# Altium project Power Distribution Board.PrjPcb (part 2 of 2)

## Sheet SH7 - LOAD MONITORING 2.SchDoc: Load Monitoring 2
size B; CheckedBy: Lance Bantoto; DrawnBy: Cindy Li; Engineer: Cindy Li; Organization: UW Robotics; Address1: 200 University Avenue; Address2: Waterloo; Address3: Ontario; Address4: Canada N2L 3G6; DocumentNumber: 7; Revision: 2; SheetNumber: 7; SheetTotal: 10
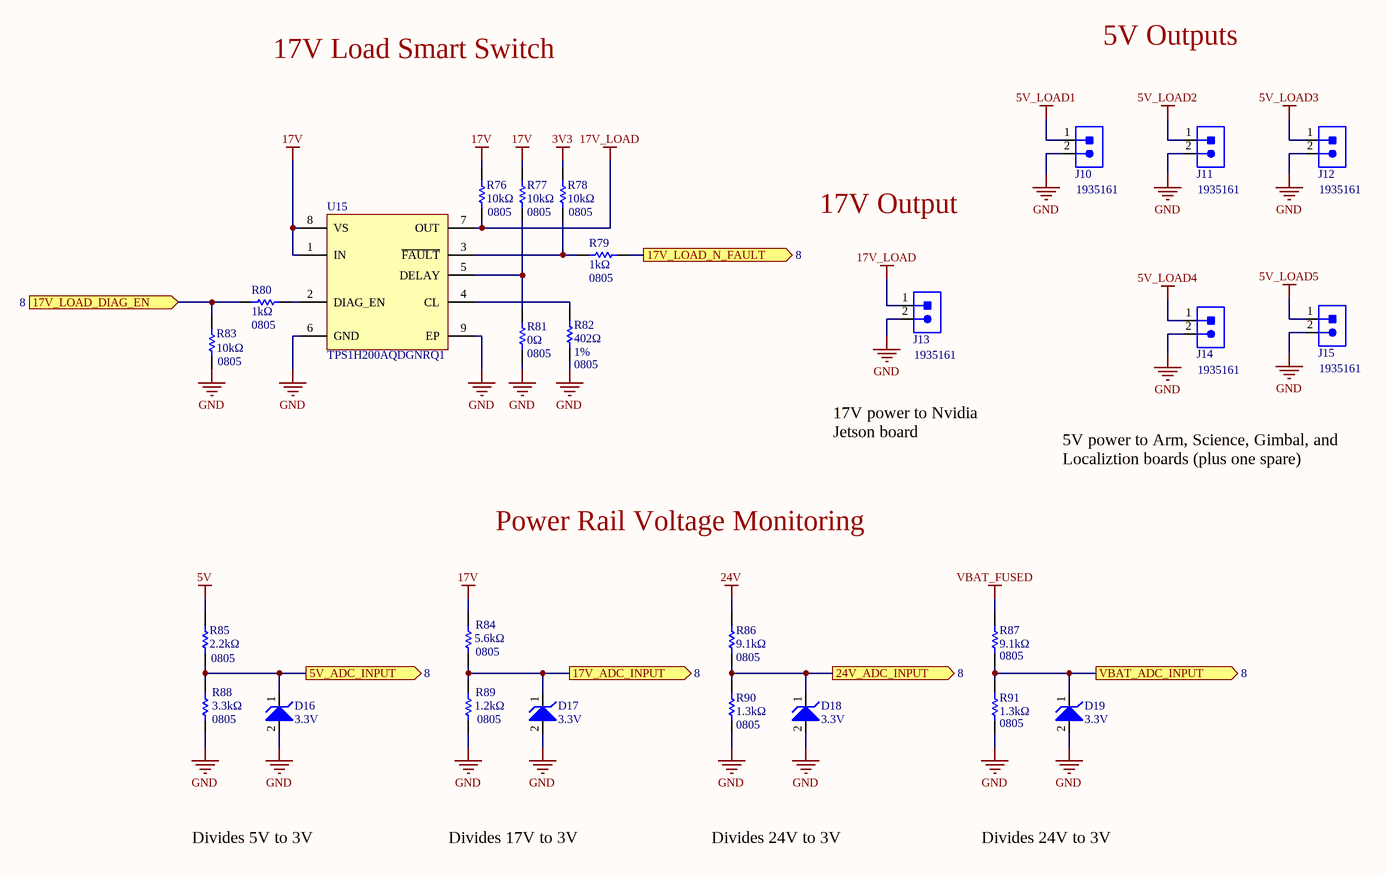
[diagram p6: SH7 - LOAD MONITORING 2.SchDoc]

### Parts
D16  Reverse Standoff Voltage: 3.3V  [SOD523]  (hidden comment: TVS_DIODE_UNIDIR_3.3V)
D17  Reverse Standoff Voltage: 3.3V  [SOD523]  (hidden comment: TVS_DIODE_UNIDIR_3.3V)
D18  Reverse Standoff Voltage: 3.3V  [SOD523]  (hidden comment: TVS_DIODE_UNIDIR_3.3V)
D19  Reverse Standoff Voltage: 3.3V  [SOD523]  (hidden comment: TVS_DIODE_UNIDIR_3.3V)
J10  CON_2M_TERM  [1935161]  (value not drawn)
J11  CON_2M_TERM  [1935161]  (value not drawn)
J12  CON_2M_TERM  [1935161]  (value not drawn)
J13  CON_2M_TERM  [1935161]  (value not drawn)
J14  CON_2M_TERM  [1935161]  (value not drawn)
J15  CON_2M_TERM  [1935161]  (value not drawn)
R76  value 10kΩ  Package/Footprint: 0805  [RESC0805]  (hidden comment: RES_10kΩ_0805_5%)
R77  value 10kΩ  Package/Footprint: 0805  [RESC0805]  (hidden comment: RES_10kΩ_0805_5%)
R78  value 10kΩ  Package/Footprint: 0805  [RESC0805]  (hidden comment: RES_10kΩ_0805_5%)
R79  Resistance: 1kΩ  Package/Footprint: 0805  [RESC0805]  (hidden comment: RES_1kΩ_0805_1%)
R80  Resistance: 1kΩ  Package/Footprint: 0805  [RESC0805]  (hidden comment: RES_1kΩ_0805_1%)
R81  value 0Ω  Package/Footprint: 0805  [RESC0805]  (hidden comment: RES_0Ω_0805)
R82  value 402Ω  Tolerance: 1%  Package/Footprint: 0805  [RESC0805]  (hidden comment: RES_402Ω_0805_1%)
R83  value 10kΩ  Package/Footprint: 0805  [RESC0805]  (hidden comment: RES_10kΩ_0805_5%)
R84  value 5.6kΩ  Package: 0805  [RESC0805]  (hidden comment: RES_5.6kΩ_0805)
R85  value 2.2kΩ  Package: 0805  [RESC0805]  (hidden comment: RES_2.2kΩ_0805)
R86  value 9.1kΩ  Package: 0805  [RESC0805]  (hidden comment: RES_9.1kΩ_0805)
R87  value 9.1kΩ  Package: 0805  [RESC0805]  (hidden comment: RES_9.1kΩ_0805)
R88  Resistance: 3.3kΩ  Package/Footprint: 0805  [RESC0805]  (hidden comment: RES_3.3kΩ_0805_1%)
R89  value 1.2kΩ  Package: 0805  [RESC0805]  (hidden comment: RES_1.2kΩ_0805)
R90  value 1.3kΩ  Package: 0805  [RESC0805]  (hidden comment: RES_1.3kΩ_0805)
R91  value 1.3kΩ  Package: 0805  [RESC0805]  (hidden comment: RES_1.3kΩ_0805)
U15  Manufacturer Part Number 1: TPS1H200AQDGNRQ1  [DGN0008G]  (hidden comment: TPS1H200A-Q1)

### Ports
5V_ADC_INPUT (out, see 8), 17V_ADC_INPUT (out, see 8), 17V_LOAD_DIAG_EN (in, see 8), 17V_LOAD_N_FAULT (out, see 8), 24V_ADC_INPUT (out, see 8), VBAT_ADC_INPUT (out, see 8)

### Nets
3V3: R78.2
5V: R85.2
5V_LOAD1: J10.1
5V_LOAD2: J11.1
5V_LOAD3: J12.1
5V_LOAD4: J14.1
5V_LOAD5: J15.1
17V: R76.2 R77.2 R84.2 U15.1(IN) U15.8(VS)
17V_LOAD: J13.1 R76.1 U15.7(OUT)
24V: R86.2
GND: D16.2 D17.2 D18.2 D19.2 J10.2 J11.2 J12.2 J13.2 J14.2 J15.2 R81.1 R82.1 R83.1 R88.1 R89.1 R90.1 R91.1 U15.6(GND) U15.9(EP)
VBAT_FUSED: R87.2
NetD16_1: D16.1 R85.1 R88.2 ; port 5V_ADC_INPUT
NetD17_1: D17.1 R84.1 R89.2 ; port 17V_ADC_INPUT
NetD18_1: D18.1 R86.1 R90.2 ; port 24V_ADC_INPUT
NetD19_1: D19.1 R87.1 R91.2 ; port VBAT_ADC_INPUT
NetR77_1: R77.1 R81.2 U15.5(DELAY)
NetR78_1: R78.1 R79.1 U15.3(~{FAULT})
NetR79_2: R79.2 ; port 17V_LOAD_N_FAULT
NetR80_1: R80.1 R83.2 ; port 17V_LOAD_DIAG_EN
NetR80_2: R80.2 U15.2(DIAG_EN)
NetR82_2: R82.2 U15.4(CL)

### Notes on the sheet
- 5V Outputs
- 17V Load Smart Switch
- 17V Output
- 17V power to Nvidia Jetson board
- 5V power to Arm, Science, Gimbal, and Localiztion boards (plus one spare)
- Power Rail Voltage Monitoring
- Divides 5V to 3V
- Divides 17V to 3V
- Divides 24V to 3V
- Title:
- Project:
- Date:
- Rev:
- Reviewer:
- Engineer:
- Sheet:
- of

### Library data of the parts
D16-D19 = TVS_DIODE_UNIDIR_3.3V: TVS DIODE 3.3V 14.1V SOD523; Manufacturer 1: ON Semiconductor; Manufacturer Part Number 1: ESD5Z3.3T1G; Polarity: Unidirectional; Reverse Breakdown Voltage: 5V; Package/Footprint: SOD-523; Supplier 1: Digi-Key; Clamping Voltage: 14.1V; Supplier Part Number 1: ESD5Z3.3T1GOSCT-ND; LCSC Part #: C61148; Mounting Type: SMD
J10-J15 = CON_2M_TERM: TERM BLK 2POS SIDE ENTRY 5MM; Manufacturer 1: Phoenix Contact; Max Current Rating: 16A; Current: 18A; Voltage: 300V; Package/Footprint: SMD; Supplier 1: Digi-Key; Supplier Part Number 1: 277-1667-ND; Manufacturer Part Number 1: 1935161; Mounting Type: TH
R76-R78 R83 = RES_10kΩ_0805_5%: RES 10K OHM 5% 1/8W 0805; Manufacturer 1: Panasonic Electronic Components; Manufacturer Part Number 1: ERJ-6GEYJ103V; Supplier Part Number 1: P10KACT-ND; Supplier 1: Digi-Key; LCSC Part #: C17414; Mounting Type: SMD
R79 R80 = RES_1kΩ_0805_1%: RES 1K OHM 1% 1/8W 0805; Manufacturer 1: Yageo; Manufacturer Part Number 1: RC0805FR-071KL; Supplier Part Number 1: 311-1.00KCRCT-ND; Supplier 1: Digi-Key; Tolerance: 1%; LCSC Part #: C17513; Mounting Type: SMD
R81 = RES_0Ω_0805: as R37 on sheet SH6 - LOAD MONITORING 1; Supplier Part Number 1: P0.0ACT-ND; Supplier 1: Digi-Key; LCSC Part #: C17477; Mounting Type: SMD
R82 = RES_402Ω_0805_1%: RES 402 OHM 1% 1/8W 0805; Manufacturer 1: Stackpole Electronics Inc; Manufacturer Part Number 1: RMCF0805FT402R; Supplier 1: Digi-Key; Supplier Part Number 1: RMCF0805FT402RCT-ND; LCSC Part #: C17681; Mounting Type: SMD
R84 = RES_5.6kΩ_0805_5%: RES SMD 5.6K OHM 5% 1/8W 0805; Manufacturer 1: Yageo; Manufacturer Part Number 1: RC0805JR-075K6L; Supplier Part Number 1: 311-5.6KARCT-ND; Supplier 1: Digi-Key; Tolerance: 5%
R85 = RES_2.2kΩ_0805_5%: RES 2.2K OHM 5% 1/8W 0805; Manufacturer 1: Vishay Dale; Manufacturer Part Number 1: CRCW08052K20JNEAC; Supplier Part Number 1: 541-4169-1-ND; Supplier 1: Digi-Key; Tolerance: 5%
R86 R87 = RES_9.1kΩ_0805_5%: RES SMD 9.1K OHM 5% 1/8W 0805; Manufacturer 1: Yageo; Manufacturer Part Number 1: RC0805JR-079K1L; Supplier Part Number 1: 311-9.1KARCT-ND; Supplier 1: Digi-Key; Tolerance: 5%
R88 = RES_3.3kΩ_0805_1%: RES 3.3K OHM 1% 1/8W 0805; Manufacturer 1: Vishay Dale; Manufacturer Part Number 1: CRCW06033K30FKEA; Supplier 1: Digi-Key; Supplier Part Number 1: 541-3.30KHCT-ND; Tolerance: 1%; LCSC Part #: C26010; Mounting Type: SMD
R89 = RES_1.2kΩ_0805_5%: RES SMD 1.2K OHM 5% 1/8W 0805; Manufacturer 1: Yageo; Manufacturer Part Number 1: RC0805JR-071K2L; Supplier 1: Digi-Key; Supplier Part Number 1: 311-1.2KARCT-ND; Tolerance: 5%
R90 R91 = RES_1.3kΩ_0805_5%: RES SMD 1.3K OHM 5% 1/8W 0805; Manufacturer 1: Yageo; Manufacturer Part Number 1: RC0805JR-071K3L; Supplier 1: Digi-Key; Supplier Part Number 1: 311-1.3KARCT-ND; Tolerance: 5%
U15 = TPS1H200A-Q1: IC PWR DRIVER N-CHAN 1:1 8MSOP; Manufacturer 1: Texas Instruments; Output Type: N-Channel; Supply Voltage: 4V - 40V; Output Current (Max): 2.5A; Rds On (Typ): 200mOhm; Package/Footprint: 8-TSSOP; Supplier 1: Digi-Key; Supplier Part Number 1: 296-50416-1-ND; Operating Temperature: 40°C - 125°C; Mounting Type: SMD

## Sheet SH8 - MICROCONTROLLER.SchDoc: Microcontroller
size B; CheckedBy: Lance Bantoto; Engineer: Cindy Li; Organization: UW Robotics; Address1: 200 University Avenue; Address2: Waterloo; Address3: Ontario; Address4: Canada N2L 3G6; DocumentNumber: 8; Revision: 2; SheetNumber: 8; SheetTotal: 10
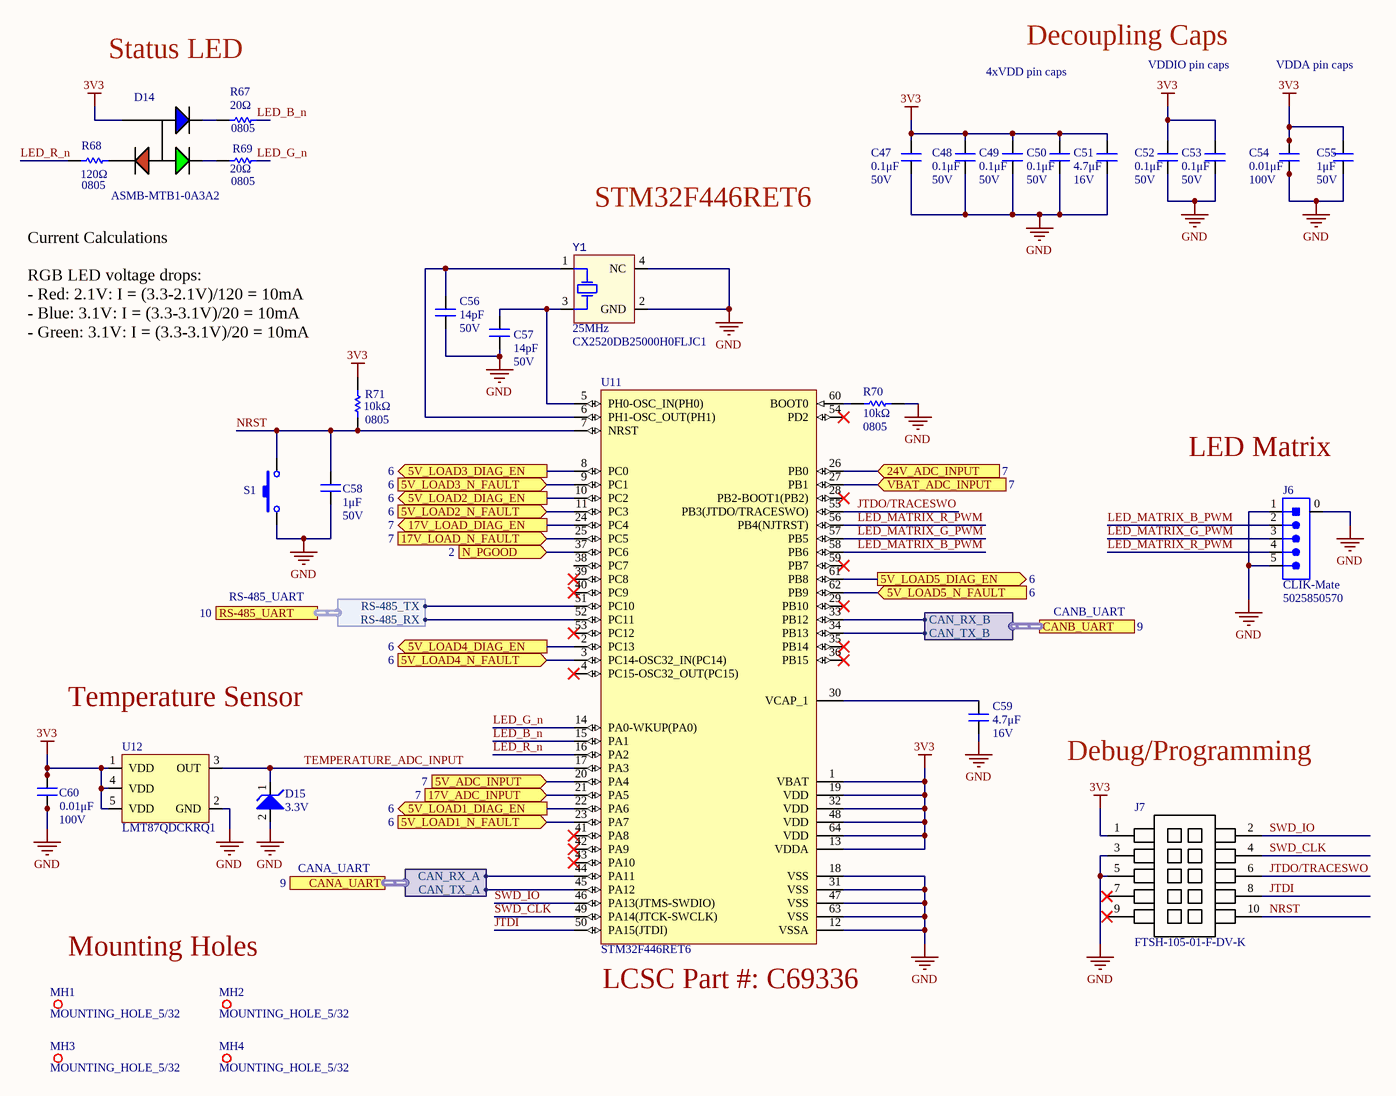
[diagram p7: SH8 - MICROCONTROLLER.SchDoc]

### Parts
C47  value 0.1μF  Voltage Rating: 50V  [CAP2012]  (hidden comment: CAP_0.1uF_50V_0805)
C48  value 0.1μF  Voltage Rating: 50V  [CAP2012]  (hidden comment: CAP_0.1uF_50V_0805)
C49  value 0.1μF  Voltage Rating: 50V  [CAP2012]  (hidden comment: CAP_0.1uF_50V_0805)
C50  value 0.1μF  Voltage Rating: 50V  [CAP2012]  (hidden comment: CAP_0.1uF_50V_0805)
C51  value 4.7μF  Voltage Rating: 16V  [CAP2012]  (hidden comment: CAP_4.7uF_16V_0805)
C52  value 0.1μF  Voltage Rating: 50V  [CAP2012]  (hidden comment: CAP_0.1uF_50V_0805)
C53  value 0.1μF  Voltage Rating: 50V  [CAP2012]  (hidden comment: CAP_0.1uF_50V_0805)
C54  value 0.01μF  Voltage Rating: 100V  [CAP2012]  (hidden comment: CAP_0.01uF_100V_0805)
C55  value 1μF  Voltage Rating: 50V  [CAP2012]  (hidden comment: CAP_1uF_50V_0805)
C56  value 14pF  Voltage Rating: 50V  [CAP0603]  (hidden comment: CAP_14pF_50V_0603)
C57  value 14pF  Voltage Rating: 50V  [CAP0603]  (hidden comment: CAP_14pF_50V_0603)
C58  value 1μF  Voltage Rating: 50V  [CAP2012]  (hidden comment: CAP_1uF_50V_0805)
C59  value 4.7μF  Voltage Rating: 16V  [CAP2012]  (hidden comment: CAP_4.7uF_16V_0805)
C60  value 0.01μF  Voltage Rating: 100V  [CAP2012]  (hidden comment: CAP_0.01uF_100V_0805)
D14  Manufacturer Part Number 1: ASMB-MTB1-0A3A2  [LED_RGB]  (hidden comment: LED_RGB)
D15  Reverse Standoff Voltage: 3.3V  [SOD523]  (hidden comment: TVS_DIODE_UNIDIR_3.3V)
J6  Family: CLIK-Mate  Manufacturer Part Number 1: 5025850570  [MOLEX-5025850570]  (hidden comment: CON_5M_SM_RA)
J7  Manufacturer Part Number 1: FTSH-105-01-F-DV-K  [FTSH-105-01-F-DV-K-P-TR]  (hidden comment: CON_PROGRAMMING)
MH1  MOUNTING_HOLE_5/32  [MOUNTING_HOLE_5/38]  (no BOM)
MH2  MOUNTING_HOLE_5/32  [MOUNTING_HOLE_5/38]  (no BOM)
MH3  MOUNTING_HOLE_5/32  [MOUNTING_HOLE_5/38]  (no BOM)
MH4  MOUNTING_HOLE_5/32  [MOUNTING_HOLE_5/38]  (no BOM)
R67  value 20Ω  Package/Footprint: 0805  [RESC0805]  (hidden comment: RES_20Ω_0805_1%)
R68  Resistance: 120Ω  Package/Footprint: 0805  [RESC0805]  (hidden comment: RES_120Ω_0805_1%)
R69  value 20Ω  Package/Footprint: 0805  [RESC0805]  (hidden comment: RES_20Ω_0805_1%)
R70  value 10kΩ  Package/Footprint: 0805  [RESC0805]  (hidden comment: RES_10kΩ_0805_5%)
R71  value 10kΩ  Package/Footprint: 0805  [RESC0805]  (hidden comment: RES_10kΩ_0805_5%)
S1  SW_TACTILE  [B3U-1000P]  (value not drawn)
U11  STM32F446RET6  [STM-LQFP64_L]
U12  Manufacturer Part Number 1: LMT87QDCKRQ1  [SOT65P210X110-5N]  (hidden comment: IC TEMPERATURE_SENSOR)
Y1  Frequency: 25MHz  Manufacturer Part Number 1: CX2520DB25000H0FLJC1  [SOIC254P1016X440-4N]  (hidden comment: CRYSTAL_25MHZ)

### Ports
5V_ADC_INPUT (in, see 7), 5V_LOAD1_DIAG_EN (out, see 6), 5V_LOAD1_N_FAULT (in, see 6), 5V_LOAD2_DIAG_EN (out, see 6), 5V_LOAD2_N_FAULT (in, see 6), 5V_LOAD3_DIAG_EN (out, see 6), 5V_LOAD3_N_FAULT (in, see 6), 5V_LOAD4_DIAG_EN (out, see 6), 5V_LOAD4_N_FAULT (in, see 6), 5V_LOAD5_DIAG_EN (out, see 6), 5V_LOAD5_N_FAULT (in, see 6), 17V_ADC_INPUT (in, see 7), 17V_LOAD_DIAG_EN (out, see 7), 17V_LOAD_N_FAULT (in, see 7), 24V_ADC_INPUT (in, see 7), CANA_UART (harness CANA_UART, see 9), CANB_UART (harness CANB_UART, see 9), N_PGOOD (in, see 2), RS-485_UART (harness RS-485_UART, see 10), VBAT_ADC_INPUT (in, see 7)

### Harnesses
CANA_UART: CAN_RX_A, CAN_TX_A
CANB_UART: CAN_RX_B, CAN_TX_B
RS-485_UART: RS-485_TX, RS-485_RX

### Nets
3V3: C47.2 C48.2 C49.2 C50.2 C51.2 C52.2 C53.2 C54.2 C55.2 C60.2 D14.4(COMMON_ANODE) J7.1 R71.2 U11.1(VBAT) U11.13(VDDA) U11.19(VDD) U11.32(VDD) U11.48(VDD) U11.64(VDD) U12.1(VDD) U12.4(VDD) U12.5(VDD)
GND: C47.1 C48.1 C49.1 C50.1 C51.1 C52.1 C53.1 C54.1 C55.1 C56.1 C57.1 C58.1 C59.1 C60.1 D15.2 J6.0 J6.1 J6.5 J7.3 J7.5 R70.2 S1.1 U11.12(VSSA) U11.18(VSS) U11.31(VSS) U11.47(VSS) U11.63(VSS) U12.2(GND) Y1.2(GND) Y1.4(NC)
JTDI: J7.8 U11.50(PA15(JTDI))
JTDO/TRACESWO: J7.6 U11.55(PB3(JTDO/TRACESWO))
LED_B_n: R67.2 U11.15(PA1)
LED_G_n: R69.2 U11.14(PA0-WKUP(PA0))
LED_MATRIX_B_PWM: J6.2 U11.58(PB6)
LED_MATRIX_G_PWM: J6.3 U11.57(PB5)
LED_MATRIX_R_PWM: J6.4 U11.56(PB4(NJTRST))
LED_R_n: R68.1 U11.16(PA2)
NRST: C58.2 J7.10 R71.1 S1.2 U11.7(NRST)
SWD_CLK: J7.4 U11.49(PA14(JTCK-SWCLK))
SWD_IO: J7.2 U11.46(PA13(JTMS-SWDIO))
TEMPERATURE_ADC_INPUT: D15.1 U11.17(PA3) U12.3(OUT)
NetC56_2: C56.2 U11.6(PH1-OSC_OUT(PH1)) Y1.1(HOT)
NetC57_2: C57.2 U11.5(PH0-OSC_IN(PH0)) Y1.3(HOT)
NetC59_2: C59.2 U11.30(VCAP_1)
NetD14_1: D14.1(CATHODE_(RED)) R68.2
NetD14_2: D14.2(CATHODE_(GREEN)) R69.1
NetD14_3: D14.3(CATHODE_(BLUE)) R67.1
NetD16_1: U11.20(PA4) ; port 5V_ADC_INPUT
NetD17_1: U11.21(PA5) ; port 17V_ADC_INPUT
NetD18_1: U11.26(PB0) ; port 24V_ADC_INPUT
NetD19_1: U11.27(PB1) ; port VBAT_ADC_INPUT
NetR11_1: U11.37(PC6) ; port N_PGOOD
NetR33_2: U11.23(PA7) ; port 5V_LOAD1_N_FAULT
NetR34_2: U11.3(PC14-OSC32_IN(PC14)) ; port 5V_LOAD4_N_FAULT
NetR35_1: U11.22(PA6) ; port 5V_LOAD1_DIAG_EN
NetR36_1: U11.2(PC13) ; port 5V_LOAD4_DIAG_EN
NetR49_2: U11.11(PC3) ; port 5V_LOAD2_N_FAULT
NetR50_2: U11.62(PB9) ; port 5V_LOAD5_N_FAULT
NetR51_1: U11.10(PC2) ; port 5V_LOAD2_DIAG_EN
NetR52_1: U11.61(PB8) ; port 5V_LOAD5_DIAG_EN
NetR62_2: U11.9(PC1) ; port 5V_LOAD3_N_FAULT
NetR63_1: U11.8(PC0) ; port 5V_LOAD3_DIAG_EN
NetR70_1: R70.1 U11.60(BOOT0)
NetR79_2: U11.25(PC5) ; port 17V_LOAD_N_FAULT
NetR80_1: U11.24(PC4) ; port 17V_LOAD_DIAG_EN
NetTP13_1: U11.52(PC11) ; port RS-485_UART.RS-485_RX
NetTP14_1: U11.51(PC10) ; port RS-485_UART.RS-485_TX
NetU11_33: U11.33(PB12) ; port CANB_UART.CAN_RX_B
NetU11_34: U11.34(PB13) ; port CANB_UART.CAN_TX_B
NetU11_44: U11.44(PA11) ; port CANA_UART.CAN_RX_A
NetU11_45: U11.45(PA12) ; port CANA_UART.CAN_TX_A

Not connected (* = marked no-connect by the designer): J7 7* 9*; U11 4(PC15-OSC32_OUT(PC15))* 28(PB2-BOOT1(PB2))* 29(PB10)* 35(PB14)* 36(PB15)* 38(PC7) 39(PC8)* 40(PC9)* 41(PA8)* 42(PA9)* 43(PA10)* 53(PC12)* 54(PD2)* 59(PB7)*

### Notes on the sheet
- Status LED
- 4xVDD pin caps
- Decoupling Caps
- VDDIO pin caps
- VDDA pin caps
- STM32F446RET6
- Current Calculations
  RGB LED voltage drops:
  - Red: 2.1V: I = (3.3-2.1V)/120 = 10mA
  - Blue: 3.1V: I = (3.3-3.1V)/20 = 10mA
  - Green: 3.1V: I = (3.3-3.1V)/20 = 10mA
- (near J6) LED Matrix
- Temperature Sensor
- Debug/Programming
- Mounting Holes
- (near U11) LCSC Part #: C69336
- Title:
- Project:
- Date:
- Rev:
- Reviewer:
- Engineer:
- Sheet:
- of

### Library data of the parts
C47-C50 C52 C53 = CAP_0.1uF_50V_0805: as C17 on sheet SH2 - 24V BUCK-BOOST CONVERTER; Supplier Part Number 1: 490-8049-1-ND; Supplier 1: Digi-Key; Mount: Surface Mount; Dielectric: X7R; Length: 2mm; Height: 1.25mm; Width: 0.049inch; Thickness: 0.049inch; Depth: 1.25mm; Ratings: AEC-Q200; LCSC Part #: C49678; Mounting Type: SMD
C51 C59 = CAP_4.7uF_16V_0805: CAP CER 4.7UF 16V X5R 0805; Manufacturer Part Number 1: CL21A475KOFNNNE; Manufacturer 1: Samsung Electro-Mechanics; Package/Footprint: 0805; Supplier Part Number 1: 1276-1065-1-ND; Supplier 1: Digi-Key; Dielectric: X5R; LCSC Part #: C1779; Mounting Type: SMD
C54 C60 = CAP_0.01uF_100V_0805: CAP CER 10000PF 100V X7R 0805; Manufacturer Part Number 1: 08051C103KAT2A; Manufacturer 1: AVX Corporation; Package/Footprint: 0805; Supplier Part Number 1: 478-1358-1-ND; Supplier 1: Digi-Key; Dielectric: X7R; LCSC Part #: C1710; Mounting Type: SMD
C55 C58 = CAP_1uF_50V_0805: CAP CER 1UF 50V X7R 0805; Manufacturer 1: Samsung Electro-Mechanics; Manufacturer Part Number 1: CL21B105KBFNNNG; Tolerane: ±10%; Package/Footprint: 0805; Temperature Coefficient: X7R; Supplier Part Number 1: 1276-6470-1-ND; Supplier 1: Digi-Key; LCSC Part #: C28323; Mounting Type: SMD
C56 C57 = CAP_14pF_50V_0603: CAP CER 14PF 50V C0G/NP0 0603; Manufacturer 1: Samsung; Manufacturer Part Number 1: CL10C140JB8NNNC; Dielectric: C0G; Package/Footprint: 0603; Supplier 1: Digi-Key; Supplier Part Number 1: 1276-2187-1-ND; Mounting Type: SMD
D14 = LED_RGB: LED RGB DIFFUSED 4PLCC SMD; Manufacturer 1: Broadcom; Color: Blue,Green,Red; Lens Color: White; Viewing Angle: 115°; Lens Style: Round; Luminous Intensity: 350mcd; Dominant Wavelength: 470nm; Forward Voltage: 3.1V; Test Current: 20mA; Package/Footprint: 4-PLCC; Supplier 1: Digi-Key; Case/Package: PLCC; Number of Pins: 4; Lens Transparency: Diffused; Length: 3.2mm; Height: 1.9mm; Width: 2.8mm; Supplier Part Number 1: 516-3280-1-ND; Mounting Type: SMD
D15 = TVS_DIODE_UNIDIR_3.3V: as D16 on sheet SH7 - LOAD MONITORING 2; Supplier 1: Digi-Key; Clamping Voltage: 14.1V; Supplier Part Number 1: ESD5Z3.3T1GOSCT-ND; LCSC Part #: C61148; Mounting Type: SMD
J6 = CON_5M_SM_RA: CONN HEADER SMD RIGHT ANGLE 1.5MM PITCH; Manufacturer 1: Molex; Connector Type: Receptacle,Center Strip Contact; Number of Positions: 5; Current Rating: 2A; Supplier 1: Digi-Key; Supplier Part Number 1: WM14469CT-ND; Termination: Solder; Number of Contacts: 5; Orientation: Right Angle; Number of Circuits: 5; Number of Rows: 1; Mounting Type: SMD; Package/Footprint: SMD
J7 = CON_PROGRAMMING: CONN HEADER SMD 10POS 1.27MM; Manufacturer 1: Samtec; Max Current Rating: 1.75A; Supplier 1: Digi-Key; Pitch: 1.27mm; Supplier Part Number 1: SAM8796-ND; Mounting Type: SMD; Package/Footprint: SMD
R67 R69 = RES_20Ω_0805_1%: RES 20 OHM 1% 1/8W 0805; Manufacturer 1: Yageo; Manufacturer Part Number 1: RC0805FR-0720RL; Tolerance: 1%; Supplier Part Number 1: 311-20.0CRCT-ND; Supplier 1: Digi-Key; LCSC Part #: C17581; Mounting Type: SMD
R68 = RES_120Ω_0805_1%: RES 120 OHM 1% 1/8W 0805; Manufacturer 1: Vishay; Manufacturer Part Number 1: CRCW0805120RFKEA; Supplier Part Number 1: 541-120CCT-ND; Supplier 1: Digi-Key; LCSC Part #: C17437; Mounting Type: SMD
R70 R71 = RES_10kΩ_0805_5%: as R76 on sheet SH7 - LOAD MONITORING 2; Supplier Part Number 1: P10KACT-ND; Supplier 1: Digi-Key; LCSC Part #: C17414; Mounting Type: SMD
S1 = SW_TACTILE: SWITCH TACTILE SPST-NO 0.05A 12V; Manufacturer 1: Omron Electronics Inc-EMC Div; Package/Footprint: SMD; Manufacturer Part Number 1: B3U-1000P; Supplier 1: Digi-Key; Supplier Part Number 1: SW1020CT-ND; Mounting Type: SMD
U11 = MCU_STM32F446RET6: ARM Cortex-M4 32-bit MCU+FPU, 512 KB Flash, 128 KB Internal RAM, 50 I/Os, 64-Pin LQFP, -40 to 85 degC, Tray; I/Os (High Current): 50; Supply Voltage(Vcc) min (V): 1.7; Operating Frequency(F) (Processor speed) (MHz): 180; D/A Converter: 2; Internal RAM Size (kB): 128; FLASH Size (Prog) (kB): 512; Core: ARM Cortex-M4; ComponentLink1Description: Manufacturer URL; Package Reference: 64-Pin Low-profile Quad Flat Package, Body 10 x 10 mm, Pitch 0.5 mm; ComponentLink2URL: http://www.st.com/st-web-ui/static/active/en/resource/technical/document/datasheet/DM00141306.pdf; Packing: Tray; DatasheetVersion: Rev. 6; ComponentLink1URL: http://www.st.com/; ComponentLink2Description: Datasheet; Package Description: LQFP64; Mounting Technology: Surface Mount; Supplier Part Number 1: 497-15376-ND; Supplier 1: Digi-Key
U12 = IC TEMPERATURE_SENSOR: SENSOR ANALOG -50C-150C SC70; Manufacturer 1: Texas Instruments; Package/Footprint: SC-70; Supplier Part Number 1: 296-40298-1-ND; Supplier 1: Digi-Key; LCSC Part #: C206058; Mounting Type: SMD
Y1 = CRYSTAL_25MHZ: CRYSTAL 25.0000MHZ 12PF SMD; Manufacturer 1: Kyocera AVX; Load Capacitance: 12pF; Supplier 1: Digi-Key; Supplier Part Number 1: 1253-1724-1-ND; Mounting Type: SMD; Package/Footprint: SMD

## Sheet SH9 - CAN.SchDoc: CAN
size B; CheckedBy: Lance Bantoto; Engineer: Cindy Li; Organization: UW Robotics; Address1: 200 University Avenue; Address2: Waterloo; Address3: Ontario; Address4: Canada N2L 3G6; DocumentNumber: 9; Revision: 2; SheetNumber: 9; SheetTotal: 10
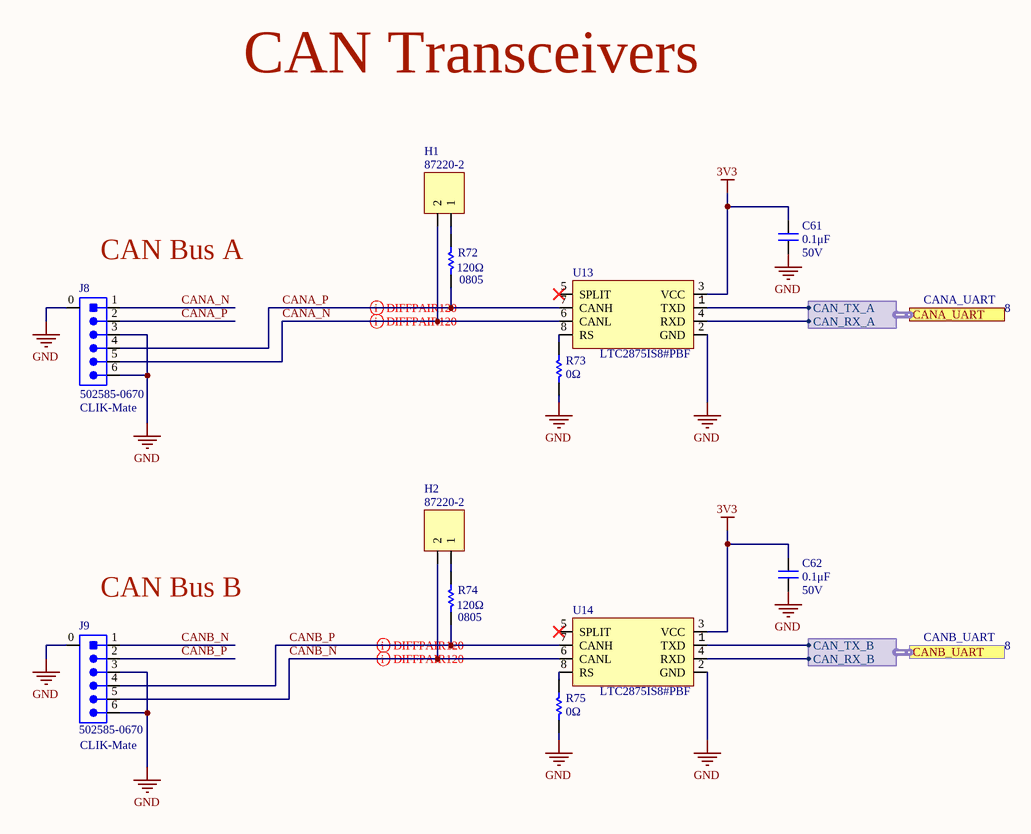
[diagram p8: SH9 - CAN.SchDoc]

### Parts
C61  value 0.1μF  Voltage Rating: 50V  [CAP2012]  (hidden comment: CAP_0.1uF_50V_0805)
C62  value 0.1μF  Voltage Rating: 50V  [CAP2012]  (hidden comment: CAP_0.1uF_50V_0805)
H1  Manufacturer Part Number 1: 87220-2  [HDR1X2]  (hidden comment: JUMPER_2)
H2  Manufacturer Part Number 1: 87220-2  [HDR1X2]  (hidden comment: JUMPER_2)
J8  Manufactor Number: 502585-0670  Family: CLIK-Mate  [MOLEX-5025850670]  (hidden comment: CON_6M_SM_RA_1.5mm)
J9  Manufactor Number: 502585-0670  Family: CLIK-Mate  [MOLEX-5025850670]  (hidden comment: CON_6M_SM_RA_1.5mm)
R72  Resistance: 120Ω  Package/Footprint: 0805  [RESC0805]  (hidden comment: RES_120Ω_0805_1%)
R73  value 0Ω  [RESC0805]  (hidden comment: RES_0Ω_0805)
R74  Resistance: 120Ω  Package/Footprint: 0805  [RESC0805]  (hidden comment: RES_120Ω_0805_1%)
R75  value 0Ω  [RESC0805]  (hidden comment: RES_0Ω_0805)
U13  Manufacturer Part Number 1: LTC2875IS8#PBF  [LT-S8_N]  (hidden comment: LTC2875)
U14  Manufacturer Part Number 1: LTC2875IS8#PBF  [LT-S8_N]  (hidden comment: LTC2875)

### Ports
CANA_UART (harness CANA_UART, see 8), CANB_UART (harness CANB_UART, see 8)

### Harnesses
CANA_UART: CAN_RX_A, CAN_TX_A
CANB_UART: CAN_RX_B, CAN_TX_B

### Nets
3V3: C61.1 C62.1 U13.3(VCC) U14.3(VCC)
GND: C61.2 C62.2 J8.0 J8.3 J8.6 J9.0 J9.3 J9.6 R73.1 R75.1 U13.2(GND) U14.2(GND)
CANA_N: H1.2 J8.1 J8.5 U13.6(CANL)
CANA_P: J8.2 J8.4 R72.1 U13.7(CANH)
CANB_N: H2.2 J9.1 J9.5 U14.6(CANL)
CANB_P: J9.2 J9.4 R74.1 U14.7(CANH)
NetH1_1: H1.1 R72.2
NetH2_1: H2.1 R74.2
NetR73_2: R73.2 U13.8(RS)
NetR75_2: R75.2 U14.8(RS)
NetU11_33: U14.4(RXD) ; port CANB_UART.CAN_RX_B
NetU11_34: U14.1(TXD) ; port CANB_UART.CAN_TX_B
NetU11_44: U13.4(RXD) ; port CANA_UART.CAN_RX_A
NetU11_45: U13.1(TXD) ; port CANA_UART.CAN_TX_A

Not connected (* = marked no-connect by the designer): U13 5(SPLIT)*; U14 5(SPLIT)*

### Layout directives
differential pair: CANA_N, CANA_P, CANB_N, CANB_P

### Notes on the sheet
- CAN Transceivers
- (near J8) CAN Bus A
- (near J9) CAN Bus B
- Title:
- Project:
- Date:
- Rev:
- Reviewer:
- Engineer:
- Sheet:
- of

### Library data of the parts
C61 C62 = CAP_0.1uF_50V_0805: CAP CER 0.1UF 50V X7R 0805; Manufacturer Part Number 1: GCM21BR71H104KA37K; Manufacturer 1: Murata Electronics; Tolerance: 10%; Package/Footprint: 0805; Supplier Part Number 1: 490-8049-1-ND; Supplier 1: Digi-Key; Mount: Surface Mount; Dielectric: X7R; Length: 2mm; Height: 1.25mm; Width: 0.049inch; Thickness: 0.049inch; Depth: 1.25mm; Ratings: AEC-Q200; LCSC Part #: C49678; Mounting Type: SMD
H1 H2 = JUMPER_2: HEADER 2X1; Manufacturer 1: TE Connectivity; Package/Footprint: TH; Supplier 1: Digi-Key; Supplier Part Number 1: A26542-ND; Mount: Through Hole; Mounting Type: TH
J8 J9 = CON_6M_SM_RA_1.5mm: CONN HEADER SMD RIGHT ANGLE 1.5 MM PITCH; Manufacturer: Molex; Supplier 1: Digi-Key; Supplier Part Number 1: WM12832CT-ND; Package/Footprint: SMD; Mounting Type: SMD
R72 R74 = RES_120Ω_0805_1%: RES 120 OHM 1% 1/8W 0805; Manufacturer 1: Vishay; Manufacturer Part Number 1: CRCW0805120RFKEA; Supplier Part Number 1: 541-120CCT-ND; Supplier 1: Digi-Key; LCSC Part #: C17437; Mounting Type: SMD
R73 R75 = RES_0Ω_0805: RES 0 OHM JUMPER 1/8W 0805; Manufacturer 1: Panasonic Electronic Components; Manufacturer Part Number 1: ERJ-6GEY0R00V; Package/Footprint: 0805; Supplier Part Number 1: P0.0ACT-ND; Supplier 1: Digi-Key; LCSC Part #: C17477; Mounting Type: SMD
U13 U14 = LTC2875: IC TXRX CAN 4MBPS 8SO; Manufacturer 1: Linear Technologies; Package/Footprint: 8-SOIC; Supplier Part Number 1: LTC2875IS8#PBF-ND; Supplier 1: Digi-Key; LCSC Part #: C117076; Mounting Type: SMD

## Sheet SH10 - RS-485.SchDoc: RS-485
size B; CheckedBy: Lance Bantoto; DrawnBy: Cindy Li; Engineer: Cindy Li; Organization: UW Robotics; Address1: 200 University Avenue; Address2: Waterloo; Address3: Ontario; Address4: Canada N2L 3G6; DocumentNumber: 10; Revision: 2; SheetNumber: 10; SheetTotal: 10
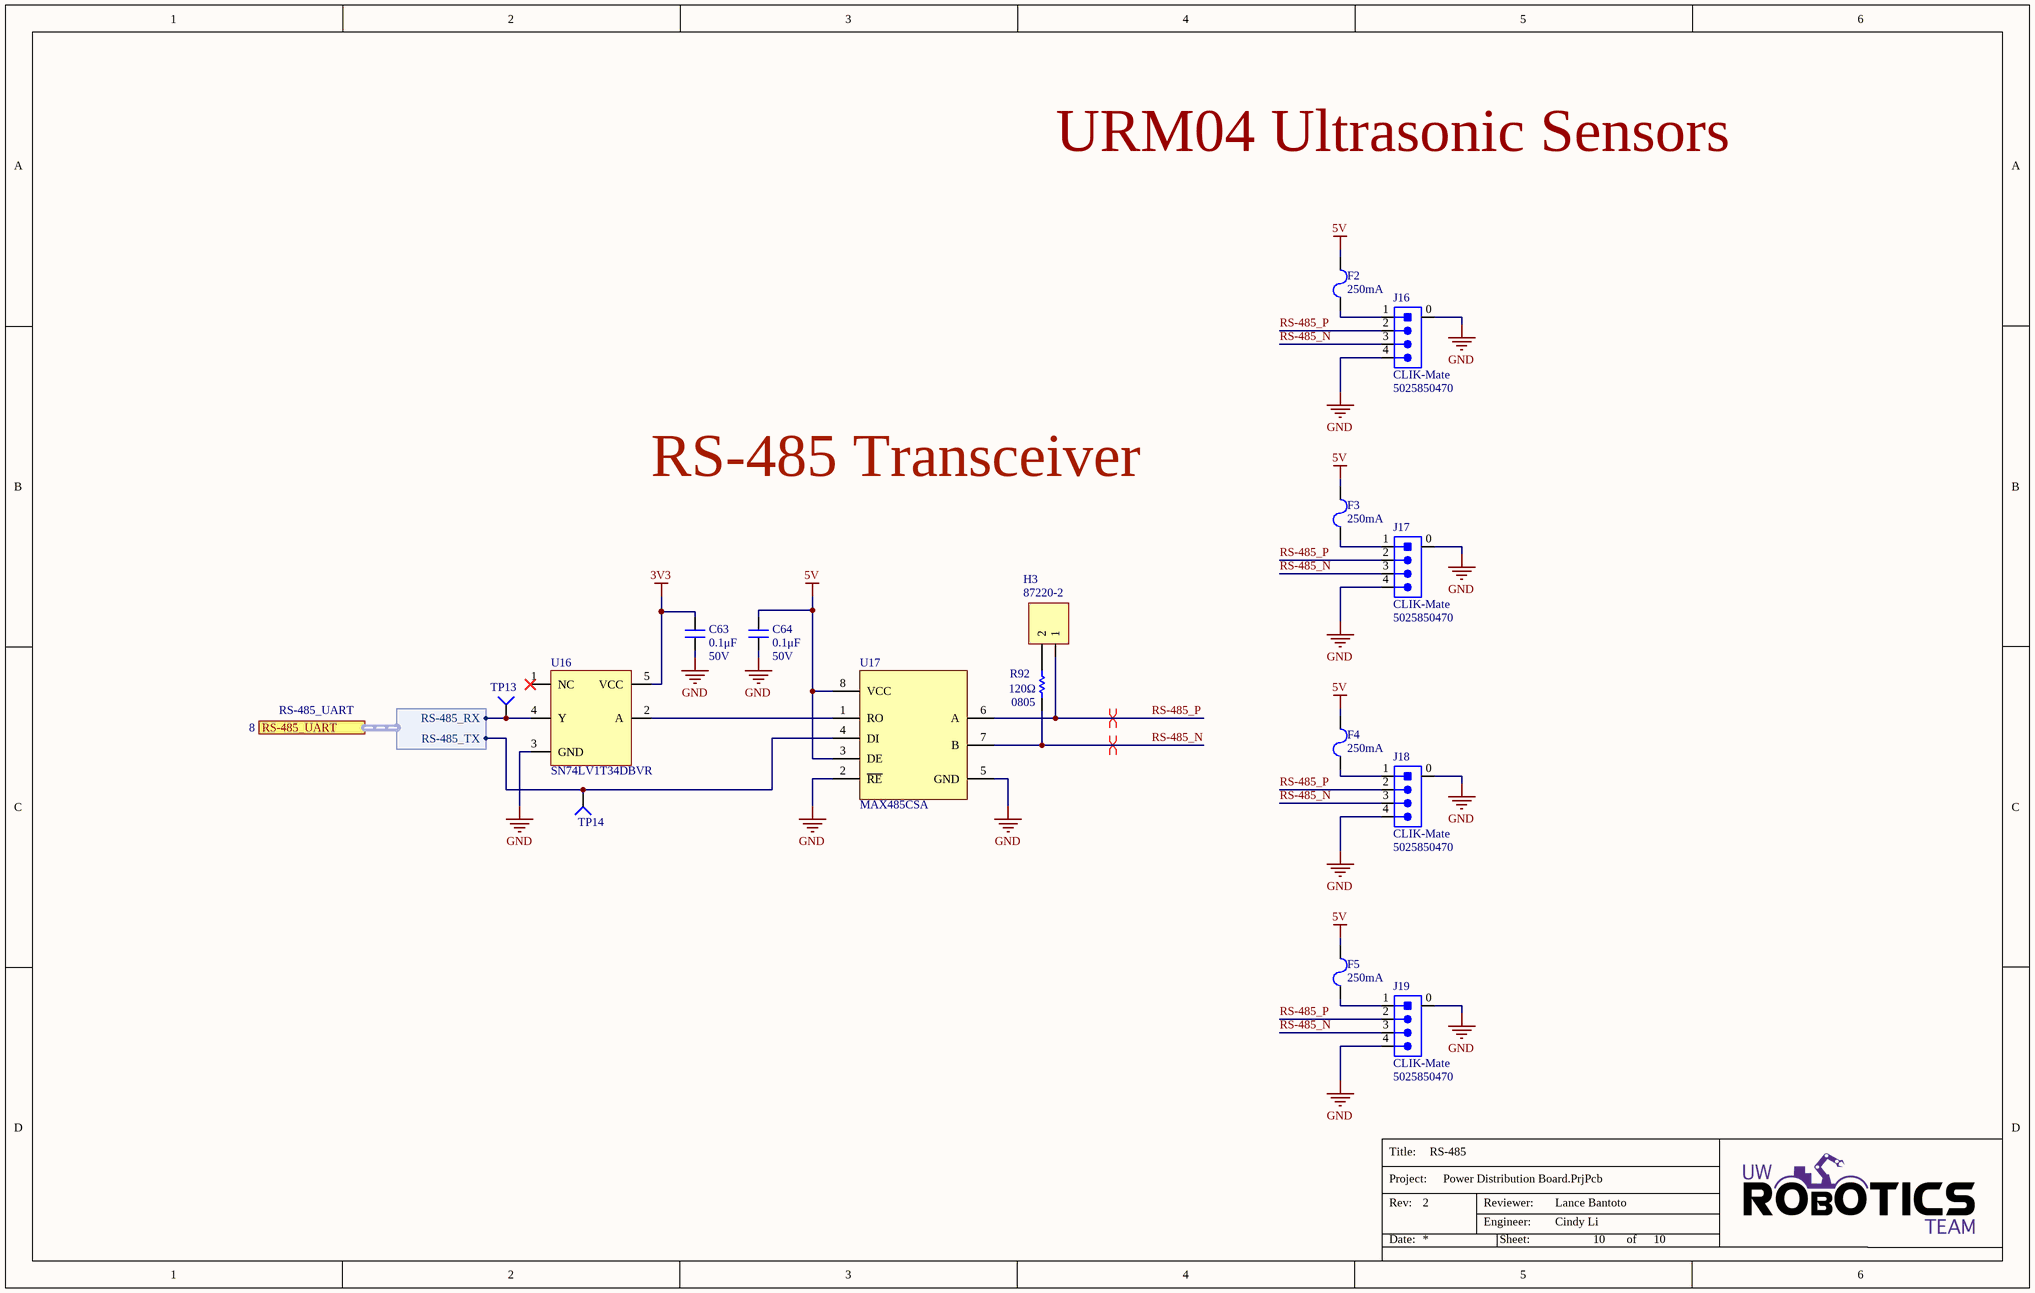
[diagram p9: SH10 - RS-485.SchDoc]

### Parts
C63  value 0.1μF  Voltage Rating: 50V  [CAP2012]  (hidden comment: CAP_0.1uF_50V_0805)
C64  value 0.1μF  Voltage Rating: 50V  [CAP2012]  (hidden comment: CAP_0.1uF_50V_0805)
F2  Current Rating: 250mA  [FUSE_1206]  (hidden comment: FUSE_250mA_1206)
F3  Current Rating: 250mA  [FUSE_1206]  (hidden comment: FUSE_250mA_1206)
F4  Current Rating: 250mA  [FUSE_1206]  (hidden comment: FUSE_250mA_1206)
F5  Current Rating: 250mA  [FUSE_1206]  (hidden comment: FUSE_250mA_1206)
H3  Manufacturer Part Number 1: 87220-2  [HDR1X2]  (hidden comment: JUMPER_2)
J16  Family: CLIK-Mate  Manufactor Number: 5025850470  [MOLEX-5025850470]  (hidden comment: CON_4M_SM_RA)
J17  Family: CLIK-Mate  Manufactor Number: 5025850470  [MOLEX-5025850470]  (hidden comment: CON_4M_SM_RA)
J18  Family: CLIK-Mate  Manufactor Number: 5025850470  [MOLEX-5025850470]  (hidden comment: CON_4M_SM_RA)
J19  Family: CLIK-Mate  Manufactor Number: 5025850470  [MOLEX-5025850470]  (hidden comment: CON_4M_SM_RA)
R92  Resistance: 120Ω  Package/Footprint: 0805  [RESC0805]  (hidden comment: RES_120Ω_0805_1%)
TP13  TESTPOINT_1MM_CIRCLE  [TESTPOINT_CIRCLE_1MM]  (value not drawn)  (no BOM)
TP14  TESTPOINT_1MM_CIRCLE  [TESTPOINT_CIRCLE_1MM]  (value not drawn)  (no BOM)
U16  SN74LV1T34  [SN74LV1T34DBVR]  (value not drawn)
U17  MAX485CSA  [SOIC127P600X175-8N]

### Ports
RS-485_UART (harness RS-485_UART, see 8)

### Harnesses
RS-485_UART: RS-485_RX, RS-485_TX

### Nets
3V3: C63.1 U16.5(VCC)
5V: C64.1 F2.2 F3.2 F4.2 F5.2 U17.3(DE) U17.8(VCC)
GND: C63.2 C64.2 J16.0 J16.4 J17.0 J17.4 J18.0 J18.4 J19.0 J19.4 U16.3(GND) U17.2(~{RE}) U17.5(GND)
RS-485_N: J16.3 J17.3 J18.3 J19.3 R92.1 U17.7(B)
RS-485_P: H3.1 J16.2 J17.2 J18.2 J19.2 U17.6(A)
NetF2_1: F2.1 J16.1
NetF3_1: F3.1 J17.1
NetF4_1: F4.1 J18.1
NetF5_1: F5.1 J19.1
NetH3_2: H3.2 R92.2
NetTP13_1: TP13.1(=value) U16.4(Y) ; port RS-485_UART.RS-485_RX
NetTP14_1: TP14.1(=value) U17.4(DI) ; port RS-485_UART.RS-485_TX
NetU16_2: U16.2(A) U17.1(RO)

Not connected (* = marked no-connect by the designer): U16 1(NC)*

### Layout directives
differential pair: RS-485_N, RS-485_P

### Notes on the sheet
- URM04 Ultrasonic Sensors
- RS-485 Transceiver
- Title:
- Project:
- Date:
- Rev:
- Reviewer:
- Engineer:
- Sheet:
- of

### Library data of the parts
C63 C64 = CAP_0.1uF_50V_0805: as C61 on sheet SH9 - CAN; Supplier Part Number 1: 490-8049-1-ND; Supplier 1: Digi-Key; Mount: Surface Mount; Dielectric: X7R; Length: 2mm; Height: 1.25mm; Width: 0.049inch; Thickness: 0.049inch; Depth: 1.25mm; Ratings: AEC-Q200; LCSC Part #: C49678; Mounting Type: SMD
F2-F5 = FUSE_250mA_1206: FUSE BOARD MNT 250MA 125VAC/VDC; Manufacturer 1: Littelfuse; Manufacturer Part Number 1: 0466.250NR; DC Cold Resistance: 31mR; Power Dissipation: 157.5mW; Approvals: UL,CSA; Working Voltage: 250V; Package/Footprint: 1206; Supplier 1: Digi-Key; Supplier Part Number 1: F1452CT-ND; Current: 250mA; Length: 3.18mm; Height: 0.023inch; Width: 0.06inch; Depth: 1.52mm; Mounting Type: SMD
H3 = JUMPER_2: as H1 on sheet SH9 - CAN; Supplier 1: Digi-Key; Supplier Part Number 1: A26542-ND; Mount: Through Hole; Mounting Type: TH
J16-J19 = CON_4M_SM_RA: CONN HEADER SMD RIGHT ANGLE 1.5 MM PITCH; Manufacturer: Molex; Supplier 1: Digi-Key; Supplier Part Number 1: WM9449CT-ND; Package/Footprint: SMD; Mounting Type: SMD
R92 = RES_120Ω_0805_1%: as R72 on sheet SH9 - CAN; Supplier Part Number 1: 541-120CCT-ND; Supplier 1: Digi-Key; LCSC Part #: C17437; Mounting Type: SMD
TP13 TP14 = TESTPOINT_1MM_CIRCLE: TESTPOINT 1MM CIRCLE; Part Number (MPN): *
U16 = SN74LV1T34: IC BUF NON-INVERT 5.5V SOT23-5; Manufacturer 1: Texas Instruments; Package/Footprint: SOT-23-5; Supplier 1: Digi-Key; Supplier Part Number 1: 296-37176-1-ND; Manufacturer Part Number 1: SN74LV1T34DBVR; LCSC Part #: C100024; Mounting Type: SMD
U17 = MAX485CSA: IC TRANSCEIVER HALF 1/1 8SOIC RS422, RS485; Manufacturer 1: Maxim Integrated; Manufacturer Part Number 1: MAX485CSA+T; Data Rate: 2.5Mbps; Supply Voltage: 4.75V - 5.25V; Package/Footprint: 8-SOIC; Supplier 1: Digi-Key; Supplier Part Number 1: MAX485CSA+TCT-ND; Protocol: RS422, RS485; Mounting Type: SMD; LCSC Part #: C9945

## Nets that join several sheets
3V3: SH2 - 24V BUCK-BOOST CONVERTER (R11.2), SH5 - 3.3V LINEAR REGULATOR (C46.2 R26.2 TP11.1 U5.5), SH6 - LOAD MONITORING 1 (5 pins), SH7 - LOAD MONITORING 2 (R78.2), SH8 - MICROCONTROLLER (22 pins), SH9 - CAN (C61.1 C62.1 U13.3 U14.3), SH10 - RS-485 (C63.1 U16.5)
5V: SH4 - 5V VICOR DCDC (7 pins), SH5 - 3.3V LINEAR REGULATOR (C45.2 U5.1 U5.3), SH6 - LOAD MONITORING 1 (20 pins), SH7 - LOAD MONITORING 2 (R85.2), SH10 - RS-485 (7 pins)
5V_LOAD1: SH6 - LOAD MONITORING 1 (R27.1 U6.7), SH7 - LOAD MONITORING 2 (J10.1)
5V_LOAD2: SH6 - LOAD MONITORING 1 (R43.1 U8.7), SH7 - LOAD MONITORING 2 (J11.1)
5V_LOAD3: SH6 - LOAD MONITORING 1 (R59.1 U10.7), SH7 - LOAD MONITORING 2 (J12.1)
5V_LOAD4: SH6 - LOAD MONITORING 1 (R30.1 U7.7), SH7 - LOAD MONITORING 2 (J14.1)
5V_LOAD5: SH6 - LOAD MONITORING 1 (R46.1 U9.7), SH7 - LOAD MONITORING 2 (J15.1)
17V: SH3 - 17V BUCK CONVERTER (9 pins), SH7 - LOAD MONITORING 2 (5 pins)
24V: SH2 - 24V BUCK-BOOST CONVERTER (18 pins), SH7 - LOAD MONITORING 2 (R86.2)
GND: SH1 - POWER (7 pins), SH2 - 24V BUCK-BOOST CONVERTER (35 pins), SH3 - 17V BUCK CONVERTER (15 pins), SH4 - 5V VICOR DCDC (18 pins), SH5 - 3.3V LINEAR REGULATOR (5 pins), SH6 - LOAD MONITORING 1 (25 pins), SH7 - LOAD MONITORING 2 (19 pins), SH8 - MICROCONTROLLER (30 pins), SH9 - CAN (12 pins), SH10 - RS-485 (13 pins)
VBAT_FUSED: SH1 - POWER (7 pins), SH2 - 24V BUCK-BOOST CONVERTER (9 pins), SH3 - 17V BUCK CONVERTER (C29.1 R20.2 U3.2), SH4 - 5V VICOR DCDC (5 pins), SH7 - LOAD MONITORING 2 (R87.2)
NetD16_1: SH7 - LOAD MONITORING 2 (D16.1 R85.1 R88.2), SH8 - MICROCONTROLLER (U11.20)
NetD17_1: SH7 - LOAD MONITORING 2 (D17.1 R84.1 R89.2), SH8 - MICROCONTROLLER (U11.21)
NetD18_1: SH7 - LOAD MONITORING 2 (D18.1 R86.1 R90.2), SH8 - MICROCONTROLLER (U11.26)
NetD19_1: SH7 - LOAD MONITORING 2 (D19.1 R87.1 R91.2), SH8 - MICROCONTROLLER (U11.27)
NetR11_1: SH2 - 24V BUCK-BOOST CONVERTER (R11.1 U2.17), SH8 - MICROCONTROLLER (U11.37)
NetR33_2: SH6 - LOAD MONITORING 1 (R33.2), SH8 - MICROCONTROLLER (U11.23)
NetR34_2: SH6 - LOAD MONITORING 1 (R34.2), SH8 - MICROCONTROLLER (U11.3)
NetR35_1: SH6 - LOAD MONITORING 1 (R35.1 R41.2), SH8 - MICROCONTROLLER (U11.22)
NetR36_1: SH6 - LOAD MONITORING 1 (R36.1 R42.2), SH8 - MICROCONTROLLER (U11.2)
NetR49_2: SH6 - LOAD MONITORING 1 (R49.2), SH8 - MICROCONTROLLER (U11.11)
NetR50_2: SH6 - LOAD MONITORING 1 (R50.2), SH8 - MICROCONTROLLER (U11.62)
NetR51_1: SH6 - LOAD MONITORING 1 (R51.1 R57.2), SH8 - MICROCONTROLLER (U11.10)
NetR52_1: SH6 - LOAD MONITORING 1 (R52.1 R58.2), SH8 - MICROCONTROLLER (U11.61)
NetR62_2: SH6 - LOAD MONITORING 1 (R62.2), SH8 - MICROCONTROLLER (U11.9)
NetR63_1: SH6 - LOAD MONITORING 1 (R63.1 R66.2), SH8 - MICROCONTROLLER (U11.8)
NetR79_2: SH7 - LOAD MONITORING 2 (R79.2), SH8 - MICROCONTROLLER (U11.25)
NetR80_1: SH7 - LOAD MONITORING 2 (R80.1 R83.2), SH8 - MICROCONTROLLER (U11.24)
NetTP13_1: SH8 - MICROCONTROLLER (U11.52), SH10 - RS-485 (TP13.1 U16.4)
NetTP14_1: SH8 - MICROCONTROLLER (U11.51), SH10 - RS-485 (TP14.1 U17.4)
NetU11_33: SH8 - MICROCONTROLLER (U11.33), SH9 - CAN (U14.4)
NetU11_34: SH8 - MICROCONTROLLER (U11.34), SH9 - CAN (U14.1)
NetU11_44: SH8 - MICROCONTROLLER (U11.44), SH9 - CAN (U13.4)
NetU11_45: SH8 - MICROCONTROLLER (U11.45), SH9 - CAN (U13.1)

## Assembly variants
Only Populated Components: not fitted R28 R31 R44 R47 R60 R77